# EAGLE board FindMeSAT_MB_1V2 (EAGLE 7.7.0)
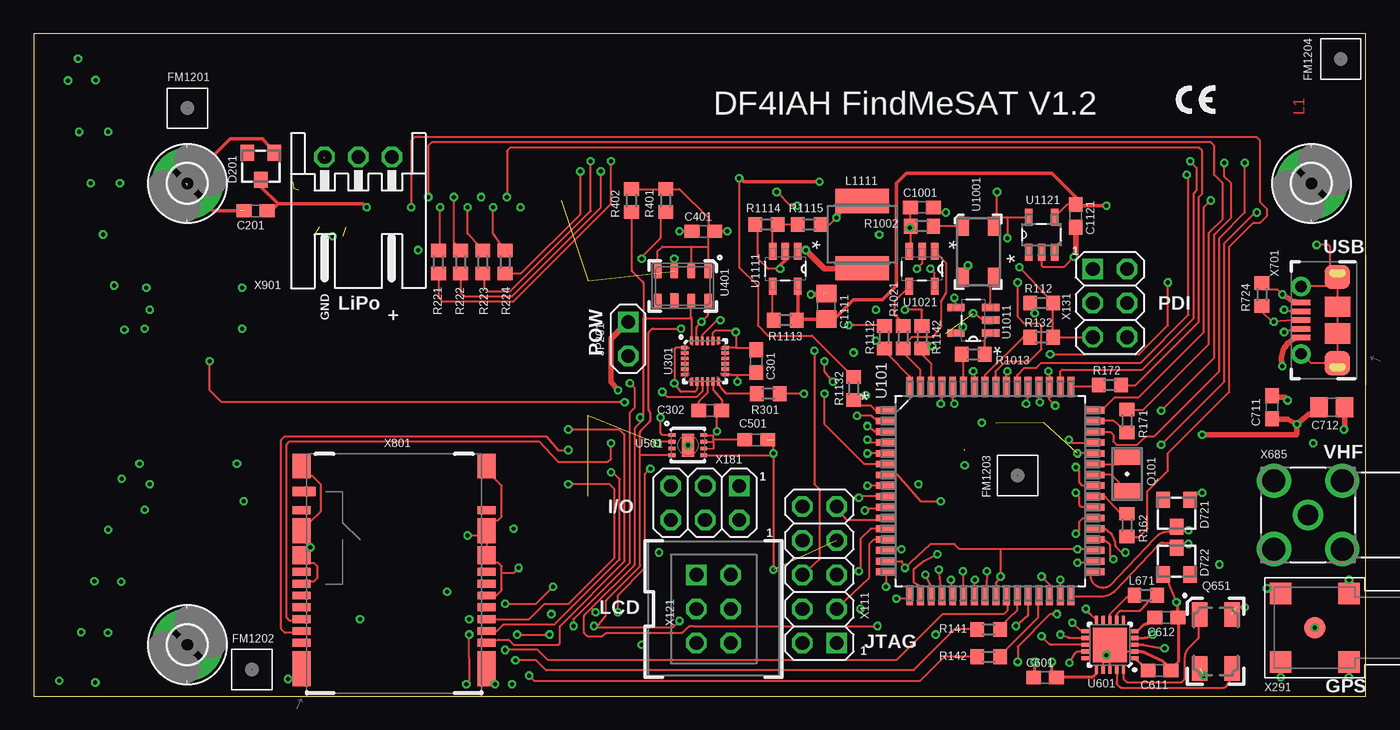
[diagram p12: board, top side]
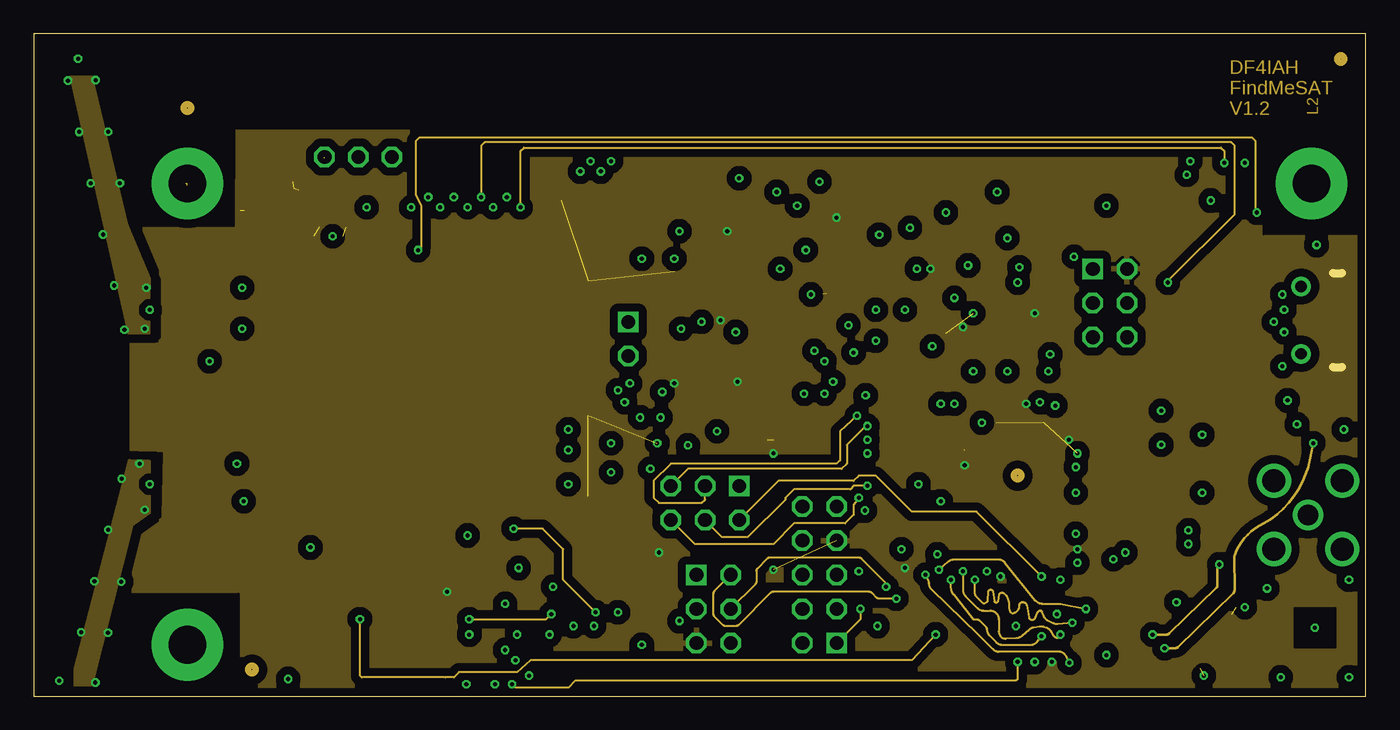
[diagram p13: board, inner layer Route2]
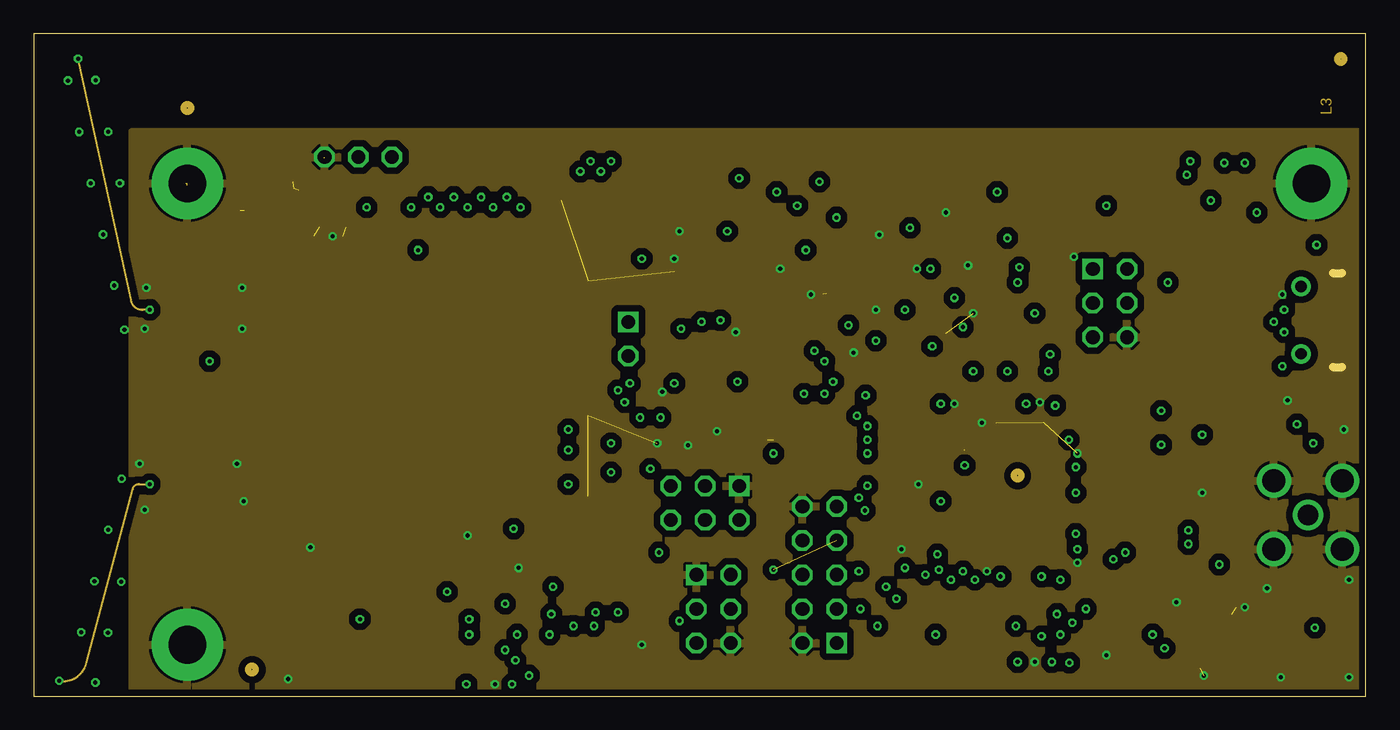
[diagram p14: board, inner layer Route15]
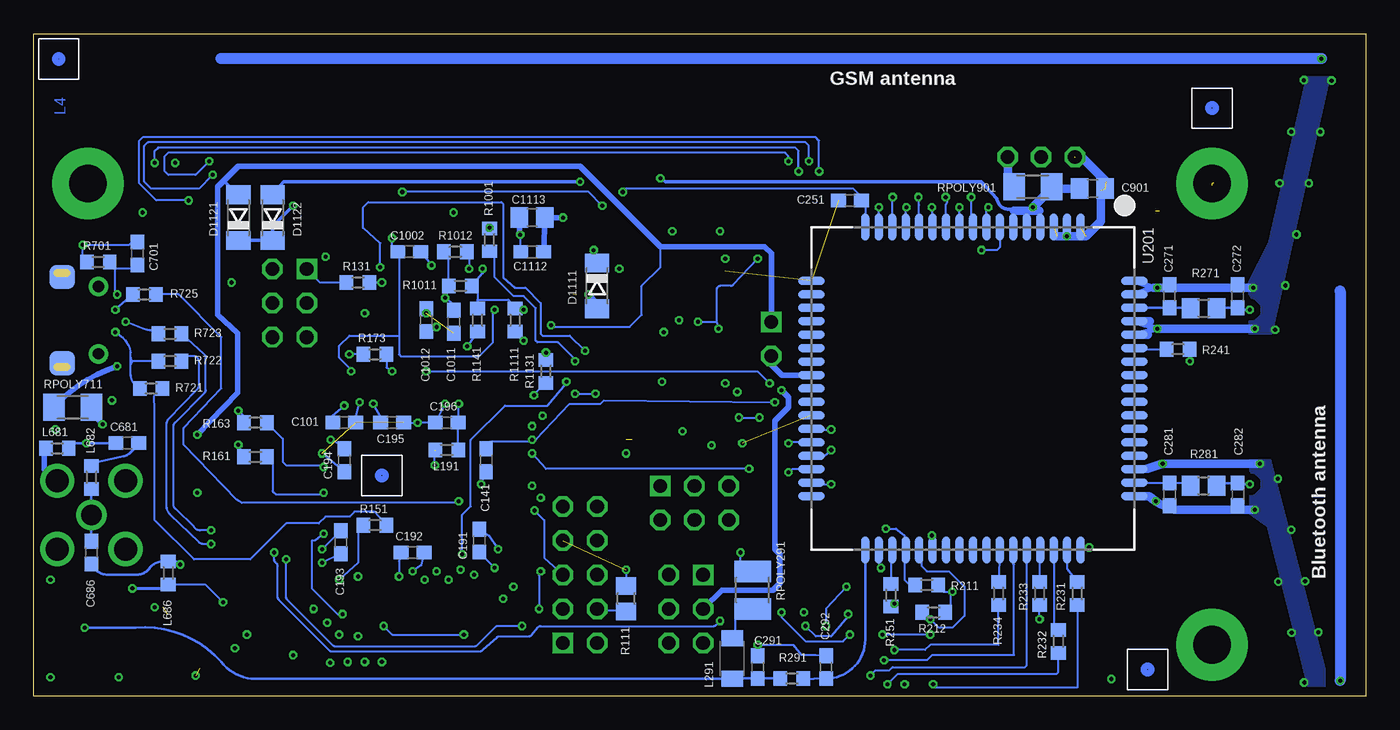
[diagram p15: board, bottom side, seen from below]

Size 99.04 x 49.23 mm. Coordinates in mm from the lower left corner, seen from the top.
Outline: 99.04,49.23 0,49.23 0,0 99.04,0 99.04,49.23
Copper layers (1+2*15+16): Top 0.035mm / dielectric 0.12mm / Route2 0.035mm / dielectric 1.2mm / Route15 0.035mm / dielectric 0.12mm / Bottom 0.035mm
Design rules "FindMeSAT_MB_1V2 *": minimum track width 6mil, minimum drill 12mil, track to track 6mil, track to pad 0.3mm, pad to pad 0.3mm, via to via 0.3mm, smd to smd 0mil, copper to edge 20mil, drill to drill 8mil, minimum pad ring 6mil, minimum via ring 6mil, stop-mask expansion 0.05mm, vias tented up to drill 0.35mm, thermal gap 0.2mm
Net classes: 1 pwr2A: width 0.8 mm; 2 R50: width 0.203 mm, clearance 0.9 mm; 3 R90_USB: width 0.15 mm, clearance 0.203 mm; 4 pwrA5: width 0.4 mm; 5 R75: width 0.15 mm, clearance 0.203 mm; 6 R110_SPI: width 0.15 mm, clearance 0.15 mm; 7 +3V3: clearance 0.5 mm; 8 GND: clearance 0.5 mm
tKeepout: area 0,0 to 99.1,49.2
bKeepout: area 0,0 to 99.1,49.2
tRestrict: area 21.6,1.3 to 31.8,17.8
bRestrict: area 19.1,12.7 to 39.4,33

## Footprints (pad centres in the part's own frame; a part is rotated, then mirrored left to right if it is on the bottom)
C0603 = smd 1.1 x 1: 1 -0.85,0; 2 0.85,0
C0805 = smd 1.3 x 1.5: 1 -0.95,0; 2 0.95,0
TO236 = smd 1 x 1.2: A -1,-1; C 0,1; NC 1,-1
SOD80C = smd 1.4 x 1.8: A 1.7,0; C -1.7,0
2,8-PAD = drill 2.8 pad 5.334: B2,8 0,0
1X02 = drill 1.016 square: 1 0,0 | drill 1.016 octagon: 2 0,2.54
R0603 = smd 1 x 1.1: 1 -0.85,0; 2 0.85,0
L3216C = smd 1.2 x 1.6: 1 -1.5,0; 2 1.5,0
L5650M = smd 1.8 x 4: 1 -2.5,0; 2 2.5,0
ABS07 = smd 1.1 x 1.9: 1 -1.25,0; 2 1.25,0
ABM03B = smd 1.8 x 1.2: 1 -2,-1.2; 2 2,-1.2; 3 2,1.2; 4 -2,1.2
R0805 = smd 1.3 x 1.5: 1 -0.95,0; 2 0.95,0
R1210 = smd 1.6 x 2.7: 1 -1.4,0; 2 1.4,0
M1206 = smd 1.6 x 2: 1 -1.4,0; 2 1.4,0
QFP80P1600X1600X120-64N = smd 1.473 x 0.508: 1 -7.747,5.994; 2 -7.747,5.207; 3 -7.747,4.394; 4 -7.747,3.607; 5 -7.747,2.794; 6 -7.747,2.007; 7 -7.747,1.194; 8 -7.747,0.406; 9 -7.747,-0.406; 10 -7.747,-1.194; 11 -7.747,-2.007; 12 -7.747,-2.794; 13 -7.747,-3.607; 14 -7.747,-4.394; 15 -7.747,-5.207; 16 -7.747,-5.994; 33 7.747,-5.994; 34 7.747,-5.207; 35 7.747,-4.394; 36 7.747,-3.607; 37 7.747,-2.794; 38 7.747,-2.007; 39 7.747,-1.194; 40 7.747,-0.406; 41 7.747,0.406; 42 7.747,1.194; 43 7.747,2.007; 44 7.747,2.794; 45 7.747,3.607; 46 7.747,4.394; 47 7.747,5.207; 48 7.747,5.994 | smd 0.508 x 1.473: 17 -5.994,-7.747; 18 -5.207,-7.747; 19 -4.394,-7.747; 20 -3.607,-7.747; 21 -2.794,-7.747; 22 -2.007,-7.747; 23 -1.194,-7.747; 24 -0.406,-7.747; 25 0.406,-7.747; 26 1.194,-7.747; 27 2.007,-7.747; 28 2.794,-7.747; 29 3.607,-7.747; 30 4.394,-7.747; 31 5.207,-7.747; 32 5.994,-7.747; 49 5.994,7.747; 50 5.207,7.747; 51 4.394,7.747; 52 3.607,7.747; 53 2.794,7.747; 54 2.007,7.747; 55 1.194,7.747; 56 0.406,7.747; 57 -0.406,7.747; 58 -1.194,7.747; 59 -2.007,7.747; 60 -2.794,7.747; 61 -3.607,7.747; 62 -4.394,7.747; 63 -5.207,7.747; 64 -5.994,7.747
SIM808 = smd 2 x 0.6: 1 -12,8; 2 -12,7; 3 -12,6; 4 -12,5; 5 -12,4; 6 -12,3; 7 -12,2; 8 -12,1; 9 -12,0; 10 -12,-1; 11 -12,-2; 12 -12,-3; 13 -12,-4; 14 -12,-5; 15 -12,-6; 16 -12,-7; 17 -12,-8; 35 12,-8; 36 12,-7; 37 12,-6; 38 12,-5; 39 12,-4; 40 12,-3; 41 12,-2; 42 12,-1; 43 12,0; 44 12,1; 45 12,2; 46 12,3; 47 12,4; 48 12,5; 49 12,6; 50 12,7; 51 12,8 | smd 0.6 x 2: 18 -8,-12; 19 -7,-12; 20 -6,-12; 21 -5,-12; 22 -4,-12; 23 -3,-12; 24 -2,-12; 25 -1,-12; 26 0,-12; 27 1,-12; 28 2,-12; 29 3,-12; 30 4,-12; 31 5,-12; 32 6,-12; 33 7,-12; 34 8,-12; 52 8,12; 53 7,12; 54 6,12; 55 5,12; 56 4,12; 57 3,12; 58 2,12; 59 1,12; 60 0,12; 61 -1,12; 62 -2,12; 63 -3,12; 64 -4,12; 65 -5,12; 66 -6,12; 67 -7,12; 68 -8,12
QFN24-3X3 = smd 0.495 x 0.25: 1 -1.552,1; 6 -1.552,-1; 13 1.552,-1; 18 1.552,1 | smd 0.6 x 0.25: 2 -1.5,0.6; 3 -1.5,0.2; 4 -1.5,-0.2; 5 -1.5,-0.6; 14 1.5,-0.6; 15 1.5,-0.2; 16 1.5,0.2; 17 1.5,0.6 | smd 0.25 x 0.495: 7 -1,-1.552; 12 1,-1.552; 19 1,1.552; 24 -1,1.552 | smd 0.25 x 0.6: 8 -0.6,-1.5; 9 -0.2,-1.5; 10 0.2,-1.5; 11 0.6,-1.5; 20 0.6,1.5; 21 0.2,1.5; 22 -0.2,1.5; 23 -0.6,1.5
MS5607-02BA = smd 1.1 x 0.6: 1 -1.1,1.875; 2 -1.1,0.625; 3 -1.1,-0.625; 4 -1.1,-1.875; 5 1.1,-1.875; 7 1.1,0.625; 8 1.1,1.875 | smd 1.1 x 0.67: 6 1.1,-0.625
DFN8/SHT = smd 0.55 x 0.25: 1 -1.177,0.765; 2 -1.177,0.265; 3 -1.177,-0.235; 4 -1.177,-0.735; 5 1.173,-0.735; 6 1.173,-0.235; 7 1.173,0.265; 8 1.173,0.765 | smd 0.9 x 1.7: 9 -0.002,0.015
QFN20-4X4-0P5-PAD = smd 0.6 x 0.3: 1 -1.85,1; 2 -1.85,0.5; 3 -1.85,0; 4 -1.85,-0.5; 5 -1.85,-1; 11 1.85,-1; 12 1.85,-0.5; 13 1.85,0; 14 1.85,0.5; 15 1.85,1 | smd 0.3 x 0.6: 6 -1,-1.85; 7 -0.5,-1.85; 8 0,-1.85; 9 0.5,-1.85; 10 1,-1.85; 16 1,1.85; 17 0.5,1.85; 18 0,1.85; 19 -0.5,1.85; 20 -1,1.85 | smd 2.55 x 2.55: 21 0,0
CFPT-141 = smd 0.9 x 1.4: 1 -1.15,1.9; 2 -1.15,-1.9; 3 1.15,-1.9; 4 1.15,1.9
SOT-23-5 = smd 1.27 x 0.559: 1 -1.295,0.94; 2 -1.295,0; 3 -1.295,-0.94; 4 1.295,-0.94; 5 1.295,0.94
SOT95P280X145-5N = smd 1.27 x 0.559: 1 -1.295,0.94; 2 -1.295,0; 3 -1.295,-0.94; 4 1.295,-0.94; 5 1.295,0.94
SOT95P285X120-5N = smd 1.27 x 0.533: 1 -1.295,0.965; 2 -1.295,0; 3 -1.295,-0.965; 4 1.295,-0.965; 5 1.295,0.965
2X05 = drill 1.016 square: 1 -5.08,-1.27 | drill 1.016 octagon: 2 -5.08,1.27; 3 -2.54,-1.27; 4 -2.54,1.27; 5 0,-1.27; 6 0,1.27; 7 2.54,-1.27; 8 2.54,1.27; 9 5.08,-1.27; 10 5.08,1.27
MOLEX_90130_2X03 = drill 1.016 square: 1 -2.54,-1.27 | drill 1.016 octagon: 2 -2.54,1.27; 3 0,-1.27; 4 0,1.27; 5 2.54,-1.27; 6 2.54,1.27
2X03 = drill 1.016 square: 1 -2.54,-1.27 | drill 1.016 octagon: 2 -2.54,1.27; 3 0,-1.27; 4 0,1.27; 5 2.54,-1.27; 6 2.54,1.27
MCX-J-P-X-RA-SM1 = smd 1.6 x 1.6: 1 0,0; 2 -2.54,2.54; 3 2.54,2.54; 4 -2.54,-2.54; 5 2.54,-2.54
SMA_SMT_AMPHENOL_901-143 = drill 1.499: 1 0,0 | drill 1.702: 2 -2.54,2.54; 3 -2.54,-2.54; 4 2.54,-2.54; 5 2.54,2.54
USB-B-MICRO-SMD_MOLEX-105017-0001 = smd 0.4 x 1.35: D+ 0,4.15; D- -0.65,4.15; GND 1.3,4.15; ID 0.65,4.15; VBUS -1.3,4.15 | drill 0.85 pad 1.45: JSHIELD -2.5,4.15; JSHIELD@2 2.5,4.15 | smd 1.8 x 1.9 bottom: JSHIELD@1 -3.2,1.45; JSHIELD@7 3.2,1.45 | smd 1.8 x 1.9: JSHIELD@3 -3.2,1.45; JSHIELD@6 3.2,1.45 | smd 1.5 x 1.9: JSHIELD@4 -1,1.45; JSHIELD@5 1,1.45
MICROSIM-8P_SDCARD-8P_MOLEX-104642-1610 = smd 1.35 x 2.6: G1 -6.875,-7.04; G8 6.875,-7.04 | smd 1.35 x 1.34: G2 -6.875,1.36; G7 6.875,1.36 | smd 1.35 x 1.84: G3 -6.875,3.2; G6 6.875,3.2 | smd 1.35 x 1.8: G4 -6.875,8.01; G5 6.875,8.01 | smd 1.35 x 0.58: S1 6.875,-5.13; S2 6.875,-4.25; S3 -6.875,-4.25; S4 -6.875,-5.13; S5 6.875,-1.61; S6 6.875,-3.37; S7 -6.875,-3.37; S8 -6.875,-1.61; T1 6.875,4.71; T2 6.875,0.15; T3 6.875,-0.73; T4 6.875,-2.49; T5 -6.875,-2.49; T6 -6.875,-0.73; T7 -6.875,0.15; T8 -6.875,4.71 | smd 1.7 x 0.7: SW -6.7,6.125
JST_S3B-XH-A = drill 1.016 octagon: 1 -2.5,-4.5; 2 0,-4.5; 3 2.5,-4.5

## Placement (x,y rotation side)
C101  100nF  [C0603]  75.95,20.32 0 bottom
C141  100pF  [C0603]  65.41,17.53 270 bottom
C191  100nF  [C0603]  65.91,11.56 90 bottom
C192  100nF  [C0603]  70.87,10.67 0 bottom
C193  100nF  [C0603]  76.2,11.43 270 bottom
C194  100nF  [C0603]  75.95,17.53 270 bottom
C195  100nF  [C0603]  72.39,20.32 0 bottom
C196  100nF  [C0603]  68.33,20.32 180 bottom
C201  100pF  [C0603]  16.51,36.07 180 top
C251  100pF  [C0603]  38.35,36.83 180 bottom
C271  0pF  [C0603]  14.61,29.72 90 bottom
C272  0pF  [C0603]  9.53,29.72 90 bottom
C281  0pF  [C0603]  14.61,14.99 270 bottom
C282  0pF  [C0603]  9.53,14.99 270 bottom
C291  0pF  [C0603]  45.21,2.16 90 bottom
C292  0pF  [C0603]  40.13,2.16 90 bottom
C301  100nF  [C0603]  53.72,24.89 90 top
C302  100nF  [C0603]  50.29,21.21 0 top
C401  100nF  [C0603]  49.78,34.54 180 top
C501  100nF  [C0603]  53.72,19.05 180 top
C601  100nF  [C0603]  75.18,1.4 180 top
C611  100nF  [C0603]  83.69,1.91 0 top
C612  100nF  [C0603]  84.2,5.84 0 top
C681  82pF  [C0603]  92.08,18.8 0 bottom
C686  150pF  [C0603]  94.74,10.67 90 bottom
C701  1nF  [C0603]  91.31,32.89 270 bottom
C711  100nF  [C0603]  92.08,21.46 90 top
C712  47uF  [C0805]  96.52,21.46 0 top
C901  100uF  [C0805]  20.32,37.72 0 bottom
C1001  10uF  [C0603]  66.04,36.32 0 top
C1002  100nF  [C0603]  71.12,33.02 0 bottom
C1011  100pF  [C0603]  67.82,27.81 270 bottom
C1012  100nF  [C0603]  69.85,27.94 90 bottom
C1111  47uF  [C0805]  58.93,28.96 90 top
C1112  100nF  [C0603]  61.98,33.02 180 bottom
C1113  47uF  [C0805]  61.98,35.56 180 bottom
C1121  100nF  [C0603]  77.47,35.69 270 top
D201  BZX84-5V1  [TO236]  16.89,39.37 180 top
D721  BZX84-3V6  [TO236]  84.96,13.59 180 top
D722  BZX84-3V6  [TO236]  84.96,10.03 0 top
D1111  CRS08  [SOD80C]  57.15,30.48 270 bottom
D1121  CRS08  [SOD80C]  83.82,35.56 90 bottom
D1122  CRS08  [SOD80C]  81.28,35.56 90 bottom
FM1201  FIDUCIAL_MARK_1MM  [FIDUCIAL_MARK_1MM]  11.43,43.69 0 top
FM1202  FIDUCIAL_MARK_1MM  [FIDUCIAL_MARK_1MM]  16.24,1.97 0 top
FM1203  FIDUCIAL_MARK_1MM  [FIDUCIAL_MARK_1MM]  73.15,16.38 0 top
FM1204  FIDUCIAL_MARK_1MM  [FIDUCIAL_MARK_1MM]  97.17,47.36 0 top
H1201  MOUNT-PAD-ROUND2.8  [2,8-PAD]  95,38.1 180 top
H1203  MOUNT-PAD-ROUND2.8  [2,8-PAD]  11.43,38.1 180 top
H1204  MOUNT-PAD-ROUND2.8  [2,8-PAD]  11.43,3.81 180 top
JP201  POW  [1X02]  44.2,27.81 180 top
L191  10uH  [R0603]  68.33,18.29 180 bottom
L291  WE-CBF_300R  [L3216C]  47.12,2.79 270 bottom
L671  22nH  [R0603]  82.68,7.49 0 top
L681  100nH  [R0603]  97.28,18.41 180 bottom
L682  56nH  [R0603]  94.74,16.26 270 bottom
L686  33nH  [R0603]  89.03,9.14 90 bottom
L1111  4.7uH  [L5650M]  61.59,34.29 270 top
Q101  ABS07-32.768KHZ  [ABS07]  81.28,16.51 90 top
Q651  ABM3B-16MHZ-10-R50-1-U  [ABM03B]  87.88,4.06 270 top
R111  0R  [R0805]  54.99,7.24 90 bottom
R112  10kR  [R0603]  74.93,29.21 180 top
R131  68R  [R0603]  74.93,30.73 0 bottom
R132  68R  [R0603]  74.93,26.67 180 top
R141  68R  [R0603]  70.99,4.95 180 top
R142  68R  [R0603]  70.99,2.92 180 top
R151  68R  [R0603]  73.66,12.7 0 bottom
R161  4.7kR  [R0603]  82.55,17.78 180 bottom
R162  68R  [R0603]  81.28,12.7 270 top
R163  68R  [R0603]  82.55,20.32 180 bottom
R171  68R  [R0603]  81.28,20.45 90 top
R172  68R  [R0603]  80.01,23.11 0 top
R173  68R  [R0603]  73.66,25.4 180 bottom
R211  10kR  [R0603]  32.64,8.26 180 bottom
R212  10kR  [R0603]  32.13,6.22 180 bottom
R221  68R  [R0603]  30.1,32.26 90 top
R222  68R  [R0603]  31.75,32.26 90 top
R223  68R  [R0603]  33.4,32.26 90 top
R224  68R  [R0603]  35.05,32.26 90 top
R231  68R  [R0603]  21.46,7.62 270 bottom
R232  68R  [R0603]  22.86,4.06 270 bottom
R233  68R  [R0603]  24.26,7.62 270 bottom
R234  68R  [R0603]  27.3,7.62 270 bottom
R241  68R  [R0603]  13.97,25.78 0 bottom
R251  68R  [R0603]  35.31,7.49 90 bottom
R271  0R  [R0805]  12.06,28.83 0 bottom
R281  0R  [R0805]  12.06,15.64 0 bottom
R291  0R  [R0603]  42.67,1.31 0 bottom
R301  68R  [R0603]  54.61,22.48 0 top
R401  10kR  [R0603]  46.99,36.83 90 top
R402  10kR  [R0603]  44.45,36.83 90 top
R701  330kR  [R0603]  94.23,32.26 0 bottom
R721  1.5kR  [R0603]  90.3,22.86 0 bottom
R722  68R  [R0603]  88.9,24.89 0 bottom
R723  68R  [R0603]  88.9,26.92 0 bottom
R724  1MR  [R0603]  91.31,29.84 90 top
R725  68R  [R0603]  90.81,29.84 0 bottom
R1001  100kR  [R0603]  65.15,33.91 90 bottom
R1002  10kR  [R0603]  66.04,34.92 0 top
R1011  100kR  [R0603]  67.31,30.48 180 bottom
R1012  330kR  [R0603]  67.69,33.02 0 bottom
R1013  47R  [R0603]  69.85,25.4 180 top
R1021  27R  [R0603]  64.64,26.67 270 top
R1111  4.02kR  [R0603]  63.25,27.94 270 bottom
R1112  6.04kR  [R0603]  63.25,26.67 90 top
R1113  100kR  [R0603]  55.88,27.94 180 top
R1114  15kR  [R0603]  54.48,35.05 0 top
R1115  68kR  [R0603]  57.66,35.05 0 top
R1131  4.02kR  [R0603]  60.96,24.13 90 bottom
R1132  6.04kR  [R0603]  60.96,22.86 270 top
R1141  100pF  [R0603]  66.04,27.94 270 bottom
R1142  2.0kR  [R0603]  66.04,26.67 90 top
RPOLY291  50mA/150mA  [R1210]  45.59,7.87 90 bottom
RPOLY711  1.1A/2.2A  [M1206]  96.14,21.46 0 bottom
RPOLY901  1.1A/2.2A  [M1206]  24.77,37.85 0 bottom
U101  ATXMEGA256A3BU-AU  [QFP80P1600X1600X120-64N]  71.12,15.24 0 top
U201  SIM808  [SIM808]  29.21,22.86 270 bottom
U301  MPU-9250  [QFN24-3X3]  49.91,24.89 0 top
U401  MS5607-02BA03  [MS5607-02BA]  48.26,30.48 270 top
U501  SHT31-DIS  [DFN8/SHT]  48.64,18.63 0 top
U601  AX5243  [QFN20-4X4-0P5-PAD]  80.01,3.81 180 top
U1001  CFPT-141-20MHZ  [CFPT-141]  70.23,33.02 0 top
U1011  OPA354  [SOT-23-5]  69.85,27.94 180 top
U1021  OPA354  [SOT-23-5]  66.04,31.75 270 top
U1111  LM2831YMF  [SOT95P280X145-5N]  55.88,31.75 270 top
U1121  LM4120IM5-3.0  [SOT95P285X120-5N]  74.93,34.29 90 top
X111  AVR-JTAG-10  [2X05]  58.42,9.02 90 top
X121  MOLEX_90130_2X03  [MOLEX_90130_2X03]  50.55,6.48 270 top
X131  HEADER-2X3  [2X03]  80.01,29.21 270 top
X181  HEADER-2X3  [2X03]  49.91,14.35 180 top
X291  MCX-J-P-X-RA-SM1  [MCX-J-P-X-RA-SM1]  95.25,5.08 270 top
X685  SMA_CON  [SMA_SMT_AMPHENOL_901-143]  94.74,13.46 270 top
X701  MOLEX_105017-0001  [USB-B-MICRO-SMD_MOLEX-105017-0001]  98.38,27.94 90 top
X801  MICROSIM-8P_SDCARD-8P_MOLEX-104642-1610  [MICROSIM-8P_SDCARD-8P_MOLEX-104642-1610]  26.8,9.09 0 top
X901  JST_S3B-XH-A  [JST_S3B-XH-A]  24.13,35.56 180 top

## Tracks (layer width: path | path; a pad name or v marks a point on that pad's centre or on a via)
+3V0  (via drill 0.3)
  Top 0.152: U1001.4 71.38,35.3 | 71.38,35.3 71.67,35.59 72.39,35.59 | 72.39,35.59 U1121.5 | 72.39,35.59 v72.39,34.04 | R1142.2 66.04,28.7 v64.77,28.7 | 75.44,23.06 U101.51 | v71.63,37.47 71.63,35.56 71.38,35.31 71.38,35.3 | v55.24,37.47 56.26,36.45 v56.77,36.45 | v75.95,21.59 75.51,22.02 U101.51 | v75.44,24.13 75.51,24.05 U101.51
  Bottom 0.152: C101.1 76.83,20.36 76.83,20.83 v75.95,21.59 | U201.17 37.17,36.96 C251.1 37.59,37.17 38.1,37.72 54.99,37.72 v55.24,37.47 | v72.39,34.04 72.39,33.34 C1002.1 71.88,32.93 71.88,26.8 | 71.88,26.8 71.88,25.4 71.75,25.27 65.91,25.27 64.9,26.29 64.9,28.57 v64.77,28.7 | v75.44,24.13 75.44,24.26 76.33,25.15 76.33,26.04 75.56,26.8 71.88,26.8 | v56.77,36.45 57.78,37.47 v71.63,37.47
+3V3  (via drill 0.3)  (3 unrouted)
  Top 0.152: U101.45 78.61,18.8 77.22,18.8 v76.96,19.05 | U101.35 78.11,10.92 v77.6,10.92 71.88,10.92 | U101.15 64.52,10.03 v64.77,9.53 66.67,11.3 68.45,11.3 68.83,10.92 71.88,10.92 | R1115.2 59.18,35.05 v59.69,35.56 | L1111.1 59.94,36.2 | U1021.5 66.98,31.45 v66.67,31.75 | U1011.5 v69.09,27.43 | R112.2 74.42,28.87 v74.42,28.45 | U301.22 49.71,26.85 50.8,27.94 v51.05,27.94 | U301.13 51.86,23.88 52.32,23.88 | U301.1 47.74,25.89 47.62,25.78 v47.62,23.24 48.13,22.61 49.15,22.61 49.31,22.77 U301.8 | U501.5 52.47,17.91 54.86,17.91 v54.99,18.03 | 75.95,1.4 C601.1 | 52.32,23.88 53.72,23.88 C301.1 | U101.25 71.53,8.41 v71.88,8.89 71.88,10.92 | v73.79,21.72 73.91,21.84 U101.53 | U401.4 46.35,31.61 46.35,33.02 46.74,33.4 48.9,33.4 | v51.56,34.54 50.67,34.54 | 50.67,34.54 C401.1 50.16,34.25 50.16,33.4 | U401.1 50.16,31.61 50.16,33.4 | 48.9,33.4 50.16,33.4 | U401.2 48.9,31.58 48.9,33.4 | 50.67,34.54 50.29,34.92 50.16,34.92 50.16,35.56 48.01,37.68 47.5,37.68 47.37,37.59 46.99,37.72 arc-180 R401.2 R402.2 | v54.99,18.03 v54.99,9.4 | v52.32,23.37 52.32,23.88 | v54.99,18.03 54.99,19.05
  Top 0.225: U601.16 79.01,1.77 arc-45 78.94,1.59 78.81,1.47 arc-45 78.64,1.4 75.95,1.4 75.69,1.4 v75.69,2.54
  Top 0.406: 59.94,36.2 v59.69,35.56
  Bottom 0.152: C195.1 73.28,20.36 73.28,20.83 v73.79,21.72 | C194.1 76.45,18.8 v76.96,19.05 | C193.1 v77.6,10.92 | C191.1 v64.77,9.53 | C192.1 71.88,10.03 v71.88,8.89 | R1012.2 66.67,32.77 66.67,31.88 66.71,31.84 v66.67,31.75 | C1012.1 v69.09,27.43 | 46.36,9.4 RPOLY291.2 46.35,9.53 46.48,9.53 v46.48,10.67 | R212.1 30.86,6.6 30.86,7.75 v30.73,7.75 31.37,7.75 31.62,8.26 R211.1 | v54.99,9.4 54.99,8.51 55.12,8.26 R111.2 | v69.22,17.14 69.22,18.29
  Bottom 0.406: C1112.1 C1113.1 v59.69,35.56
  pour Route2 (isolate 0.61, rank 2): 98.5,41.91 7.32,41.91 7.32,0.5 98.5,0.5
+5V  (via drill 0.3)
  Top 0.15: R1112.2 63.08,27.52 63.12,27.56 v60.58,27.56
  Top 0.406: v86.87,19.43 93.85,19.43 93.92,19.5 v93.92,20.19 | C712.1 95.57,21.27 95.25,20.95 94.81,20.95 v93.92,20.19 | C711.1 92.2,20.57 93.22,20.57 v93.92,20.19 | v43.43,22.73 42.93,23.37 42.93,26.54 JP201.1
  Bottom 0.15: 84.74,38.1 85.09,38.1 | v60.58,27.56 60.45,27.56 60.33,27.43 54.74,27.43 53.85,28.32 53.85,30.48 52.45,31.88 52.45,33.27 52.32,33.4
  Bottom 0.254: 83.9,37.26 84.74,38.1
  Bottom 0.406: v86.87,19.43 83.88,22.54 83.88,26.95 85.34,28.32 85.34,37.85 85.09,38.1 83.82,39.37 58.42,39.37 52.45,33.4 52.32,33.4 44.7,33.4 44.2,32.89 JP201.1 | 83.82,37.34 83.9,37.26 D1121.A | RPOLY711.2 94.61,21.59 94.36,21.34 94.36,20.7 94.17,20.51 v93.92,20.19 | v43.43,22.73 42.93,22.23 42.93,21.46 43.94,20.45 43.94,10.92 43.56,10.54 43.56,8.38 44.07,7.87 47.88,7.87 X121.3
AD_3V0  (via drill 0.3)
  Top 0.152: U101.62 66.73,24.71 66.04,25.4 R1142.1 66.17,25.91 66.72,25.91 v66.8,25.99
  Bottom 0.152: R1141.2 v66.8,25.99
AD_5V0  (via drill 0.3)
  Top 0.152: U101.64 65.13,23.77 63.5,25.4 R1112.1 63.33,25.82 v62.61,26.42
  Bottom 0.152: R1111.2 63.41,27.09 v62.61,26.42
AD_VBAT  (via drill 0.3)
  Top 0.152: U101.1 62.59,21.23 62.23,21.59 61.38,21.59 R1132.2 61.3,22.35 v61.85,22.35
  Bottom 0.152: v61.85,22.35 61.63,22.61 R1131.1
AD_VCTCXO
  Top 0.152: U101.63 65.91,24.26 64.77,25.4 R1021.2 64.77,26.04 64.77,26.16 65.28,26.67 66.8,26.67 67.44,27.43 67.44,29.34 67.82,29.97 67.82,32.21 U1021.1
AVCC  (via drill 0.3)
  Top 0.152: U101.61 67.56,22.99 v67.44,21.72
  Bottom 0.152: v67.44,21.72 67.44,20.32 C196.1 L191.1
AX_ANT
  Bottom 0.203: C686.2 X685.1 L682.2
AX_ANT_I
  Bottom 0.203: C681.2 91.72,18.22 arc36 92.39,17.81 94.19,17.4 L682.1
AX_ANTN  (via drill 0.3)
  Top 0.203: U601.4 82.41,4.31 arc34 83.12,4.53 v83.19,4.57
  Route2 0.203: v83.19,4.57 84.2,4.57 arc44 84.42,4.66 87.91,8.03 arc46 88.01,8.26 88.01,9.52 arc-45 88.1,9.74 v88.14,9.78
  Bottom 0.203: C686.1 94.57,9.57 arc-56 93.52,9.02 91.38,9.02 arc-53 90.46,9.48 arc53 89.44,9.99 L686.2 88.35,9.99 v88.14,9.78
AX_ANTP  (via drill 0.3)
  Top 0.203: U601.3 82.31,3.81 arc-10 82.54,3.79 83.82,3.56
  Top 0.225: 83.82,3.56 v84.07,3.56
  Route2 0.203: v84.07,3.56 84.83,3.56 arc44 85.06,3.65 89.19,7.65 arc46 89.28,7.88 89.27,10.4 89.29,10.47 arc-45 91.44,12.83 arc45 94.74,17.02 v95.12,18.8
  Bottom 0.203: L681.1 96.18,18.8 v95.12,18.8 C681.1
AX_CLK  (via drill 0.3)
  Top 0.152: U601.11 77.85,4.87 v77.22,5.46 | U101.23 69.93,8.59 v69.98,8.64
  Route2 0.152: v69.98,8.64 69.98,7.6 arc45 70.05,7.42 70.54,6.93 arc45 70.7,6.9 70.9,7.02 arc47 70.93,7.07 70.97,7.8 arc-136 71.32,7.78 71.41,7.03 arc129 71.71,7.06 71.78,7.57 arc-119 72.2,7.55 72.22,7.56 arc-50 72.5,6.57 72.55,6.37 arc7 72.65,6.22 72.74,6.15 arc90 73.28,6.73 arc-90 73.53,6.99 arc-80 73.83,6.74 73.99,5.87 arc98 74.31,5.68 arc50 74.47,5.82 74.61,6.19 arc-68 74.85,6.35 arc-68 74.96,6.27 75.09,5.94 arc42 75.4,5.61 75.78,5.42 arc32 76.13,5.35 v77.22,5.46
AX_IRQ  (via drill 0.3)
  Top 0.152: v77,2.47 77.38,3.14 arc-60 77.65,3.3 U601.14 | 66.73,8.08 v66.29,9.02
  Top 0.279: U101.19 66.73,8.08
  Route2 0.152: v66.29,9.02 66.5,8.61 arc-27 66.55,8.4 arc46 66.74,7.94 70.23,4.57 71.31,3.49 arc45 71.76,3.3 76.19,3.3 arc-63 76.76,2.95 v77,2.47
AX_L1
  Top 0.152: U601.8 80.01,5.99 arc-45 80.08,6.17 81.23,7.32 arc-32 81.35,7.38 L671.1
AX_L2
  Top 0.152: U601.7 80.52,5.99 arc-44 80.59,6.17 80.7,6.28 arc-45 80.88,6.35 82.18,6.35 arc49 82.37,6.44 83.19,7.37 L671.2
AX_MISO  (via drill 0.3)
  Top 0.152: U601.12 77.08,4.32 arc-21 76.85,4.36 v76.33,4.57 | v69.09,9.27 69.09,7.52
  Top 0.279: 69.09,7.52 U101.22
  Route2 0.152: v69.09,9.27 69.09,7.88 arc45 69.27,7.43 70.17,6.54 arc45 70.62,6.35 71.11,6.35 arc-45 71.56,6.16 71.57,6.16 arc-45 71.75,5.71 71.75,4.83 arc45 71.94,4.39 71.98,4.35 arc45 72.3,4.28 73.04,4.32 arc41 73.46,4.47 74.03,4.96 arc-31 74.34,5.11 74.77,5.18 arc-28 75.08,5.16 75.31,5.08 75.38,5.05 arc-37 75.66,4.76 75.74,4.6 arc63 76.2,4.32 v76.33,4.57
AX_MOSI  (via drill 0.3)
  Top 0.152: U601.13 75.7,3.81 arc-45 75.47,3.9 v74.93,4.45 | U101.21 v68.2,8.64
  Route2 0.152: v68.2,8.64 68.2,8 arc43 68.37,7.56 69.75,5.8 69.83,5.72 arc45 69.91,5.7 70,5.7 arc-45 70.32,5.62 70.78,5.16 arc-45 70.87,4.96 arc45 71.05,4.51 71.57,4 arc45 72.02,3.81 74.12,3.81 arc51 74.61,4.05 v74.93,4.45
AX_SEL  (via drill 0.3)
  Top 0.152: U601.10 78.57,6.1 v78.23,6.48 | 67.51,7.54 v67.31,9.4
  Top 0.279: U101.20 67.51,7.54
  Route2 0.152: v67.31,9.4 68.02,10.01 arc-41 68.43,10.16 71.71,10.16 arc-51 72.2,9.92 74.48,7.09 arc51 74.98,6.86 76.32,6.86 arc-11 76.34,6.86 v78.23,6.48
BATTERY
  Bottom 0.64: RPOLY901.1 26.63,37.85 X901.1
BT_ANT  (via drill 0.3)
  Route15 0.15: v1.91,1.14 arc90 3.94,2.54 7.37,15.37 arc-90 7.87,15.75 v8.64,15.75
  Bottom 0.203: R281.2 10.87,15.64 10.68,15.83 C282.1 | v8.64,15.75 9.53,15.75
  Bottom 0.604: 9.53,15.75 C282.1
  Bottom 0.8: 1.91,30.1 v1.91,1.14
BT_RF
  Bottom 0.203: U201.53 C281.1 13.6,15.85 13.39,15.64 R281.1
CLK16N
  Top 0.152: U601.19 80.51,1 arc45 80.58,0.82 80.7,0.71 arc45 80.88,0.64 88.5,0.64 arc59 88.72,0.76 89.03,1.27 89.03,1.81
  Top 0.225: 89.03,1.81 Q651.3
CLK16P
  Top 0.152: U601.20 81.01,1.39 arc45 81.08,1.21 81.21,1.09 arc45 81.39,1.02 85.24,1.02 arc45 85.42,1.09 85.52,1.2 arc45 85.6,1.38 85.6,2.89 arc-45 85.89,3.6 86.54,4.24 arc45 86.61,4.42 86.61,5.18 Q651.1
CTS1  (via drill 0.3)
  Top 0.152: U101.55 72.31,24.05 v72.39,24.13
  Bottom 0.152: R173.1 72.81,24.42 v72.39,24.13
DCD1
  Top 0.152: R171.1 80.3,20.45 U101.47
DTR1  (via drill 0.3)
  Top 0.152: U101.46 80.06,19.63 80.26,19.43 80.26,18.92 80.52,18.67 82.04,18.67 82.68,19.3 83.31,19.3 88.14,24.13 88.14,34.04 90.04,35.94 v90.04,39.62 | R222.1 31.75,29.97 32,29.72 35.56,29.72 42.16,36.32 v42.16,38.99
  Bottom 0.152: v90.04,39.62 90.04,40.51 89.79,40.77 42.42,40.77 42.16,40.51 v42.16,38.99
EN
  Top 0.152: R1113.2 54.94,28.03 U1111.4
FB
  Top 0.152: U1111.3 54.94,34.66 R1114.2 R1115.1
GAM_RO
  Top 0.152: U301.10 50.11,22.55 49.44,21.88 C302.1
GND  (via drill 0.3)  (19 unrouted)
  Top 0.152: v97.79,8.64 X291.2 | v97.79,1.4 X291.3 | v92.71,1.4 X291.5 | v91.69,8 X291.4 | v64.52,10.92 63.88,10.92 63.42,10.79 U101.14 | 70.74,7.52 U101.24 70.84,8.1 v70.87,9.27 | 70.74,7.52 70.74,7.49 | 70.74,7.52 70.87,7.75 | U101.44 v77.6,18.03 | D722.A 84.33,8.51 v84.96,6.99 85.05,7.02 | U101.34 78.11,9.91 v77.6,9.91 | v55.5,31.75 54.61,31.75 53.85,32.51 53.85,34.84 R1114.1 | U1021.2 66.04,32.13 v65.66,31.75 | X801.T6 19.95,8.38 20.32,8.51 20.83,8.51 21.08,8.76 21.08,9.65 20.83,9.91 20.45,9.91 X801.G2 20.32,10.65 v20.57,11.05 20.19,11.69 X801.G3 20.32,12.74 20.19,12.45 20.57,12.95 21.34,13.72 21.34,15.75 20.7,16.38 20.32,16.38 19.92,16.78 X801.G4 | v18.92,1.27 19.94,1.65 19.92,1.65 X801.G1 19.94,2.1 19.94,2.03 | 33.53,1.14 33.53,1.96 X801.G8 33.67,1.38 v34.29,0.89 | U1011.2 70.61,27.94 v69.85,28.45 | U1001.2 v69.47,32 | C1001.2 67.31,35.94 v67.82,35.94 | U1121.2 74.93,32 75.06,31.88 76.58,31.88 v77.34,32.64 77.47,32.77 | U301.9 49.71,22.66 49.28,22.23 47.12,22.23 v46.74,22.61 | U301.20 50.51,27.02 50.67,27.18 52.07,27.18 v52.2,27.05 52.2,25.89 | C501.2 50.55,19.05 | U501.8 50.55,19.4 | U501.7 50.55,18.9 | 50.55,18.9 50.55,19.05 | 50.55,19.05 50.55,19.4 | 50.55,19.4 v50.8,19.68 50.8,21.04 C302.2 51.18,21.63 51.18,21.97 50.51,22.77 U301.11 | 34.42,7.49 33.5,7.49 X801.S5 33.7,7.41 34.42,7.49 | X801.G6 33.67,12.3 33.66,12.32 33.66,10.5 33.67,10.5 X801.G7 34.02,9.91 34.54,9.91 34.8,9.65 34.8,9.14 | X801.G6 33.68,12.22 33.91,13.08 34.54,13.08 34.8,13.34 34.8,15.65 34.16,16.26 33.67,16.75 X801.G5 | 34.42,7.49 34.8,7.87 34.8,9.14 | 52.2,25.89 U301.18 | D721.A 85.98,14.84 v86.87,15.11 | R724.2 91.31,30.23 92.46,30.23 v92.84,29.84
  Top 0.152: U601.18 80.01,2.54 | 80.01,2.54 U601.21 | U601.17 79.51,2.53 | 79.51,2.53 79.5,2.54 | U601.2 81.03,3.31 80.01,2.54 | 79.51,2.53 80.01,2.54 | 80.01,2.54 v79.76,3.05 | U501.2 46.48,18.9 v46.35,18.8 | 52.2,25.89 53.72,25.89 C301.2 | v68.45,21.72 68.33,21.97 U101.60 | v74.8,21.84 74.73,21.92 U101.52 | v36.05,9.53 35.69,9.14 34.8,9.14 | U401.3 47.63,32.5 v47.62,32.51 | v48.01,34.54 C401.2 | U501.6 50.55,18.41 50.55,18.9 | v32.26,11.94 33.52,11.94 X801.G6 | v90.04,6.6 89.41,6.6
  Top 0.225: C601.2 74.42,1.52 v74.42,2.54 | 81.03,3.31 81.03,3.3 | U601.2 82.17,3.3 arc-25 82.65,3.2 83.78,2.68 arc-29 84.27,2.28 C611.2 84.71,2.16 85.09,2.54 85.09,5.68 C612.2 85.05,7.02
  Top 0.254: U1111.2 55.88,32.38 55.5,32 v55.5,31.75 | D201.A 17.02,41.4 14.61,41.4 11.3,38.1 | 15.37,36.07 13.34,36.07 11.43,37.97
  Top 0.406: X701.GND 93.6,29.34 v92.84,29.84 | C1121.2 77.47,32.77 | C712.2 97.47,19.75 v97.41,19.81 | C711.2 92.2,22.23 93.03,22.23 v93.22,21.97 | 58.67,29.84 v57.78,29.84
  Bottom 0.152: C292.2 40.89,3.05 41.91,3.05 42.55,3.81 v45.21,3.81 C291.2 | U201.36 36.2,10.45 36.2,9.65 v36.05,9.53 | C191.2 65.22,11.94 v64.52,10.92 | C192.2 70.23,9.72 v70.87,9.27 | C194.2 v77.6,18.03 | C101.2 75.06,20.36 75.06,20.83 v74.8,21.84 | v68.45,21.72 C196.2 v70.48,20.32 C195.2 | C193.2 v77.6,9.91 | D1111.A 57.15,29.21 | C1112.2 62.93,34.35 v62.87,34.29 | v65.66,31.75 65.66,31.41 R1011.1 66.04,30.48 R1141.1 66.04,29.46 63.75,29.46 R1111.1 62.83,28.79 v62.61,28.7 | U201.51 21.21,10.79 21.04,10.97 20.7,10.97 v20.57,11.05 | v69.85,28.45 70.23,28.51 C1012.2 | C1002.2 v69.47,32 | R1131.2 v60.96,25.53 | v65.79,15.75 C141.2 | v92.84,29.84 92.96,29.72 92.96,31.75 | 92.96,31.75 93.38,32.17 R701.2 | C701.2 91.61,31.75 92.96,31.75 | L686.1 86.27,8.29 v84.96,6.99 | U201.40 32.21,11.89 v32.26,11.94
  Bottom 0.225: v91.69,8 89.45,8 L686.1 | 98.26,18.29 L681.2
  Bottom 0.406: 57.15,29.21 v57.78,29.84 | C1113.2 62.93,34.35 | X685.2 98.26,16.85 98.26,18.29 | 15.81,30.35 U201.68 | 15.79,30.35 U201.67 | U201.65 v15.49,27.3 U201.64
  Bottom 0.64: 15.81,30.35 15.79,30.35 v15.49,30.35 14.82,30.35 C271.2 14.1,30.35 9.91,30.35 C272.2 9.31,30.35 v8.38,30.35 | U201.65 16.05,27.86 | U201.64 16.19,26.86 | v8.26,13.84 9.49,13.84 | 9.49,13.84 arc90 C282.2 9.82,13.84 | 9.49,13.84 14.22,13.84 14.52,14.14 C281.2 arc37 v15.62,14.48 16.13,14.86 U201.52 | U201.54 16.26,16.89 v15.11,17.27 v7.87,17.27 | U201.2 v22.23,34.16 | v8.26,27.3 v15.49,27.3 | 21.59,40.01 21.08,40.01 19.3,38.23 | 22.99,34.16 20.83,34.16 19.68,35.31 19.68,37.59
  other vias: 48.64,18.63 87,1.52 2.56,45.74 4.6,45.78 3.38,41.93 5.54,41.93 4.24,38.11 6.41,38.12 5.16,34.3 4.59,1.01 5.53,4.71 3.53,4.75 4.52,8.53 6.54,16.15 5.98,30.51 6.75,27.22 5.54,12.37 6.51,8.5
  pour Route15 (rank 2): 98.5,41.91 7.32,41.91 7.32,0.5 98.5,0.5
  pour Bottom (no thermals): 8.64,16.51 arc180 8.64,14.99 8.64,13.59 7.32,12.67 4.32,0.76 3.05,0.76 3.05,2.03 7.11,17.58 8.64,17.53
  pour Bottom (no thermals): 8.64,27.94 arc-180 8.64,29.46 8.69,30.73 7.2,33.7 4.36,46.02 2.73,46.01 7.01,26.93 8.64,26.92
  pour Route2 (no thermals): 8.64,16.51 arc180 8.64,14.99 8.64,13.59 7.32,12.65 4.32,0.76 3.05,0.76 3.05,2.03 7.11,17.58 8.64,17.53
  pour Route2 (no thermals): 8.64,27.94 arc-180 8.64,29.46 8.67,31 7,34.99 4.37,46.01 2.72,46.02 7.02,26.96 8.64,26.92
GPS_1PPS  (via drill 0.3)
  Top 0.152: v35.05,6.86 37.34,6.86 v38.61,8.13 | v44.32,23.24 44.7,22.86 44.7,21.46 44.32,21.08 44.32,9.91 40.13,5.71 v40.13,5.21 | 69.85,23.5 69.98,23.04 U101.58 69.93,24.05 v69.85,24.13
  Bottom 0.152: R251.1 35.34,6.86 v35.05,6.86 | v38.61,8.13 40.13,6.48 v40.13,5.21 | v69.85,24.13 45.21,24.13 v44.32,23.24
GPS_1PPS_DRV
  Bottom 0.152: U201.37 35.31,10.81 R251.2
GPS_ANT  (via drill 0.3)
  Bottom 0.203: R291.1 C291.1 47.12,1.31 | X291.1 91.44,5.08 arc53 85.09,2.54 arc-53 82.55,1.29 L291.2
  Bottom 0.64: 47.12,1.31 L291.2
  other vias: 95.25,5.08
GPS_PWR
  Bottom 0.152: L291.1 46.86,4.7 46.87,5.97 RPOLY291.1
GPS_RF_IN
  Bottom 0.203: U201.35 37.21,4.19 arc90 C292.1 41.91,1.27
  Bottom 0.406: 41.91,1.27 R291.2
GSM_ANT  (via drill 0.3)
  Route15 0.15: v8.64,28.7 8.13,28.7 arc-90 7.24,29.46 v3.3,47.37
  Bottom 0.203: R271.2 11.3,28.87 C272.1 | v8.64,28.7 9.53,28.7
  Bottom 0.604: 9.53,28.7 C272.1
  Bottom 0.8: v3.3,47.37 85.1,47.37
GSM_CTS  (via drill 0.3)
  Top 0.152: R223.2 32.26,34.38 v32.26,36.32
  Bottom 0.152: U201.12 32.21,36.53 arc-90 v32.26,36.32
GSM_DCD  (via drill 0.3)
  Top 0.152: R222.2 31.24,33.74 v31.24,37.08
  Bottom 0.152: U201.11 31.21,36.54 arc-90 v31.24,37.08
GSM_DTR  (via drill 0.3)
  Top 0.152: R171.2 82.51,21.3 87.38,26.16 87.38,34.42 88.39,35.43 88.39,38.1 87.76,38.73 87.76,40.89 87.5,41.15 29.59,41.15 29.34,40.89 v29.34,37.08
  Bottom 0.152: U201.9 29.34,35.69 v29.34,37.08
GSM_NETLIGHT  (via drill 0.3)
  Top 0.152: v32.16,0.89 32.4,0.89 32.4,1.16 v32.38,4.57 | v43.43,6.22 43.43,7.49 45.47,9.53 45.47,16.51 v45.85,16.89 | v35.94,4.57 v38.37,4.57 | U101.5 v61.98,18.03
  Bottom 0.152: v32.38,4.57 v35.94,4.57 | v43.43,6.22 43.43,5.84 41.66,4.06 38.86,4.06 v38.37,4.57 | v45.85,16.89 60.96,16.89 v61.98,18.03 | R231.2 21.46,0.64 32.26,0.64 v32.16,0.89
GSM_NETLIGHT_DRV
  Bottom 0.152: U201.50 22.21,9.47 R231.1
GSM_PCM_CLK  (via drill 0.3)
  Top 0.152: R141.2 68.45,4.95 65.41,1.91 38.1,1.91 37.34,2.67 v35.81,2.67
  Bottom 0.152: U201.46 26.21,9.78 26.16,9.78 26.16,3.05 32.26,3.05 32.64,2.67 v35.81,2.67
GSM_PCM_CLK_DRV
  Top 0.152: R141.1 71.88,5.21 73.13,6.36 U101.27
GSM_PCM_IN  (via drill 0.3)
  Top 0.152: R142.2 67.69,2.92 65.91,1.14 37.21,1.14 v36.83,1.52
  Bottom 0.152: v36.83,1.52 36.45,1.91 35.43,1.91 35.18,2.16 25.34,2.16 25.21,2.29 U201.47
GSM_PCM_IN_DRV
  Top 0.152: R142.1 72.52,3.68 74.68,5.84 74.68,7.44 U101.29
GSM_PCM_OUT  (via drill 0.3)
  Top 0.152: U101.28 73.91,5.97 v73.03,5.21
  Route2 0.152: v67.06,4.57 65.28,2.67 36.96,2.67 35.94,1.78 31.62,1.78 31.24,1.4 30.61,1.4 24.38,1.4 24.26,1.52 v24.26,5.71
  Bottom 0.152: v73.03,5.21 72.39,4.57 v67.06,4.57 | v24.26,5.71 R233.2
GSM_PCM_OUT_DRV
  Bottom 0.152: U201.48 24.26,10.41 R233.1
GSM_PCM_SYNC  (via drill 0.3)
  Top 0.152: U101.26 72.31,7.54 arc-90 72.39,7.62 72.39,6.35 72.14,6.1 67.56,6.1 64.14,2.67 38.23,2.67 37.47,3.43 v35.05,3.43
  Bottom 0.152: R234.2 27.3,3.81 32.38,3.81 32.77,3.43 v35.05,3.43
GSM_PCM_SYNC_DRV
  Bottom 0.152: U201.45 27.3,8.43 R234.1
GSM_PWRKEY  (via drill 0.3)
  Top 0.152: R162.2 82.21,11.85 81.66,11.81 82.17,11.81 82.8,12.45 82.8,15.24 84.33,16.76 84.33,18.03 88.9,22.61 88.9,33.4 90.68,35.18 91.19,35.18 91.69,35.69 91.69,36.2 91.19,36.7 91.19,41.27 90.93,41.53 28.32,41.53 28.07,41.27 v28.07,36.32
  Bottom 0.152: U201.8 28.21,36.56 arc90 v28.07,36.32
GSM_RESET  (via drill 0.3)
  Top 0.152: v83.82,21.21 87.76,25.15 87.76,34.29 89.03,35.56 89.03,38.1 88.52,38.61 v88.52,39.62
  Route2 0.152: v36.2,36.32 36.2,40.51 36.45,40.77 88.27,40.77 88.52,40.51 v88.52,39.62
  Bottom 0.152: U201.16 36.2,35.27 v36.2,36.32 | R163.2 83.4,20.79 v83.82,21.21
GSM_RF
  Bottom 0.203: R271.1 13.34,28.87 C271.1 U201.66
GSM_RF_SYNC  (via drill 0.3)
  Top 0.152: 63.32,18.8 U101.4 62.18,18.85 v61.98,19.05 | v43.94,21.84 13.97,21.84 13.08,22.73 v13.08,24.89
  Bottom 0.152: v43.94,21.84 56.64,21.97 56.9,21.72 59.18,21.72 61.72,19.05 v61.98,19.05 62.1,18.92 65.02,18.92 65.15,18.8 C141.1 | v13.08,24.89 13.08,25.78 R241.2
GSM_RF_SYNC_DRV
  Bottom 0.152: U201.63 16.73,25.78 R241.1
GSM_RI  (via drill 0.3)
  Top 0.152: R221.2 30.23,33.49 v30.23,36.32
  Bottom 0.152: U201.10 30.21,36.43 arc-90 v30.23,36.32
GSM_RTS  (via drill 0.3)
  Top 0.152: v75.56,25.4 82.17,25.4 84.33,27.56 v84.33,30.73
  Route2 0.152: v33.27,37.08 33.27,40.89 33.53,41.15 89.03,41.15 89.28,40.89 89.28,35.81 84.33,30.86 v84.33,30.73
  Bottom 0.152: U201.13 33.21,36.51 v33.27,37.08 | R173.2 v75.56,25.4
GSM_RXD  (via drill 0.3)
  Top 0.152: R172.2 81.92,23.11 86.61,27.81 86.61,37.08 86.87,37.34 86.87,40.51 86.61,40.77 35.43,40.77 35.18,40.51 v35.18,37.08
  Bottom 0.152: U201.15 35.18,35.29 v35.18,37.08
GSM_STATUS  (via drill 0.3)
  Top 0.152: v77.47,12.06 77.72,12.32 77.72,12.95 78,13.23 U101.38 | v76.07,6.1 75.56,6.1 73.15,3.68 v73.15,2.54
  Route2 0.152: v35.56,0.89 35.81,0.64 39.75,0.64 40.26,1.14 73.03,1.14 73.15,1.27 v73.15,2.54
  Bottom 0.152: v77.47,12.06 78.11,11.56 78.36,11.56 78.36,8 76.45,6.1 v76.07,6.1 | v35.56,0.89 34.8,1.65 22.99,1.65 22.86,1.78 R232.2
GSM_STATUS_DRV
  Bottom 0.152: U201.49 23.21,5.26 R232.1
GSM_TXD  (via drill 0.3)
  Top 0.152: R224.2 34.16,34.38 v34.16,36.32
  Bottom 0.152: U201.14 34.21,36.53 arc90 v34.16,36.32
GSM_VDD_EXT  (via drill 0.3)
  Top 0.152: v83.82,18.67 88.52,23.37 88.52,33.66 90.81,35.94 v90.93,35.94
  Route2 0.152: v28.57,33.15 28.83,33.4 28.83,36.45 28.45,37.21 28.45,41.27 28.7,41.53 90.55,41.53 90.81,41.27 90.81,36.07 v90.93,35.94
  Bottom 0.152: U201.7 27.21,33.37 27.43,33.15 v28.57,33.15 | R161.2 83.4,17.87 v83.82,18.67
I2C2_INT  (via drill 0.3)
  Top 0.152: U101.6 61.75,17.25 58.8,20.19 v58.8,22.48 | v57.28,22.48 55.75,22.48 R301.2
  Bottom 0.152: v58.8,22.48 v57.28,22.48
IO_ADC4  (via drill 0.3)
  Top 0.152: U101.2 62.74,20.45 62.23,20.83 v61.21,20.83
  Route2 0.152: v61.21,20.83 59.94,19.68 59.94,17.53 59.69,17.27 47.37,17.27 46.1,16 46.1,14.73 46.48,14.35 49.66,14.35 49.91,14.61 X181.3
IO_ADC5  (via drill 0.3)
  Top 0.152: U101.3 62.53,19.63 v61.98,20.07
  Route2 0.152: v61.98,20.07 61.85,20.07 60.45,18.67 60.45,17.27 60.07,16.89 48.64,16.89 X181.5
IO_DAC0  (via drill 0.3)
  Top 0.152: U101.8 61.98,15.65 v61.98,15.62
  Route2 0.152: v61.98,15.62 60.96,15.62 60.71,15.37 56.52,15.37 55.88,14.73 55.88,14.61 53.09,11.81 51.18,11.81 X181.4
IO_DAC1  (via drill 0.3)
  Top 0.152: U101.9 61.47,14.83 v61.34,14.73
  Route2 0.152: v61.34,14.73 60.96,14.22 60.96,13.46 60.33,12.83 56.52,12.83 54.99,11.3 49.15,11.3 X181.6
IO_OC1A  (via drill 0.3)
  Top 0.152: U101.30 75.51,8.31 v74.93,8.89
  Route2 0.152: X181.2 55.37,16 60.96,16 61.34,16.38 62.61,16.38 65.28,13.72 70.1,13.72 v74.93,8.89
J_D+  (via drill 0.3)
  Top 0.15: 93.6,27.94 v92.2,27.81
  Top 0.152: R724.1 91.31,28.57 92.08,27.81 v92.2,27.81
  Top 0.35: X701.D+ 93.6,27.94
  Bottom 0.15: R723.1 89.92,27.18 90.31,27.18 arc21 90.77,27.26 v92.2,27.81
J_D-  (via drill 0.3)
  Top 0.15: v92.96,27.05 93.6,27.3
  Top 0.35: X701.D- 93.89,27.26 93.81,27.26 93.6,27.3
  Bottom 0.15: R722.1 91.69,24.89 | 91.82,25.15 91.82,25.53 arc-44 92.39,26.6 v92.96,27.05
  Bottom 0.152: 91.69,24.89 91.82,24.89 | R721.1 91.44,23.11 arc53 91.82,23.88 91.82,24.64 | 91.82,24.64 91.82,24.89 | 91.82,24.89 91.82,25.15 91.69,24.89 | 91.69,24.89 91.82,24.64
J_ID  (via drill 0.3)
  Top 0.152: X701.ID 93.2,28.59 v92.96,28.7
  Bottom 0.152: R725.1 v92.96,28.7
J_SHIELD  (via drill 0.3)
  Top 0.152: 96.27,31.85 arc90 X701.JSHIELD@6 X701.JSHIELD@5 X701.JSHIELD@4 X701.JSHIELD@3 94.97,24.74 X701.JSHIELD | 96.27,31.85 96.27,30.44 X701.JSHIELD@2 | 96.27,31.85 96.39,31.85 96.39,33.4 96.27,33.53 v95.38,33.53
  Bottom 0.152: C701.1 91.73,33.74 91.95,33.53 v95.38,33.53 95.38,32.55 R701.1
J_VUSB  (via drill 0.3)
  Top 0.406: v92.84,24.51 arc-90 93.95,26.64 X701.VBUS
  Bottom 0.406: v92.84,24.51 arc-30 RPOLY711.1
MPU_INT
  Top 0.152: R301.1 51.52,22.48 51.05,22.99 50.93,23.32 U301.12
N$1
  cutout Route2 (no thermals): 91.44,41.91 98.58,41.93 98.58,34.31 91.44,34.29
N$2
  cutout Route2: 6.93,7.61 15.24,7.62 15.26,0.59 6.95,0.58
N$3
  cutout Route2: 7.62,41.91 14.89,41.91 14.87,34.93 7.6,34.93
N$4
  cutout Route2: 93.75,6.56 96.78,6.56 96.78,3.6 93.75,3.6
PDI_CLK  (via drill 0.3)
  Top 0.152: X131.5 R132.1 R112.1 75.78,29.25 73.53,31.62 v73.28,31.88 | v58.04,25.65 58.04,15.75 58.42,15.37 58.42,10.16 X111.6
  Bottom 0.152: v73.28,31.88 73.28,33.66 74.55,34.8 74.55,36.32 74.17,36.7 64.26,36.7 64.14,36.58 64.14,31.11 63.25,30.35 62.48,30.35 61.34,29.21 61.34,26.92 61.21,26.8 59.18,26.8 v58.04,25.65
PDI_CLK_CPU
  Top 0.152: U101.57 70.74,23.01 70.74,23.88 73.57,26.67 73.79,26.8 R132.2
PDI_DATA
  Bottom 0.152: R131.1 77.72,30.73 X131.1
PDI_DATA_CPU  (via drill 0.3)
  Top 0.152: U101.56 71.53,24.16 72.26,24.89 74.04,24.89 74.93,25.78 74.93,27.56 74.8,27.69 73.66,27.69 73.15,28.19 v73.15,30.73
  Bottom 0.152: v73.15,30.73 R131.2
POWERED_GSM  (via drill 0.3)
  Top 0.152: U101.39 77.9,14.05 77.72,14.22 77.72,14.86 v77.47,15.11
  Bottom 0.152: R161.1 81.28,17.36 81.28,15.24 81.03,14.99 77.6,14.99 v77.47,15.11
PWRKEY_GSM
  Top 0.152: R162.1 80.81,13.55 79.5,14.99 78.89,14.99 U101.40
RESET_GSM  (via drill 0.3)
  Top 0.152: U101.41 77.95,15.65 77.72,15.88 77.72,16.76 v77.47,17.02
  Bottom 0.152: R163.1 80.52,19.14 80.52,17.4 80.26,17.14 77.6,17.14 v77.47,17.02
RI1  (via drill 0.3)
  Top 0.152: U101.50 76.33,24.13 76.45,24.26 82.42,24.26 86.23,28.07 86.23,37.34 86.49,37.59 86.49,39.24 v85.98,39.75 | R221.1 30.1,29.59 30.35,29.34 35.69,29.34 42.93,36.58 v42.93,39.75
  Bottom 0.152: v85.98,39.75 87,38.73 89.03,38.73 89.28,38.99 89.28,40.13 89.03,40.39 43.18,40.39 42.93,40.13 v42.93,39.75
RTS1  (via drill 0.3)
  Top 0.152: U101.54 73.13,23.85 73.66,24.38 74.55,24.38 74.93,24.77 82.3,24.77 85.85,28.32 85.85,38.61 v85.72,38.73 | R223.1 33.49,31.11 33.49,30.39 33.78,30.1 35.43,30.1 41.4,36.07 v41.4,39.75
  Bottom 0.152: v85.72,38.73 86.74,37.72 90.3,37.72 90.81,38.23 90.81,40.89 90.55,41.15 41.66,41.15 41.4,40.89 v41.4,39.75
RXD1  (via drill 0.3)
  Top 0.152: U101.48 79.4,21.23 80.39,22.23 82.17,22.23 87,27.05 87,36.32 v87.5,36.83 | R224.1 36.23,31.41 40.64,35.81 v40.64,38.99
  Bottom 0.152: v87.5,36.83 89.92,36.83 91.19,38.1 91.19,41.27 90.93,41.53 40.89,41.53 40.64,41.27 v40.64,38.99
SCL1  (via drill 0.3)
  Top 0.152: 45.09,17.91 45.09,9.76 arc-45 45.01,9.58 42.62,7.19 arc45 42.55,7.01 42.55,6.06 arc-39 42.49,5.9 42.04,5.33 v41.66,5.21 41.53,5.08 47.39,5.08 arc45 47.57,5.15 v48.01,5.59 | 45.09,17.91 45.09,19.58 arc-45 45.16,19.76 45.77,20.37 arc45 45.85,20.55 45.85,20.98 arc45 45.77,21.16 arc-45 45.72,21.28 45.72,26.95 arc-45 45.79,27.12 45.9,27.23 arc-45 46.08,27.3 v48.13,27.3 | U301.23 49.28,26.43 49.28,27.33 arc-45 49.35,27.51 v49.66,27.81 50.06,28.22 arc45 50.13,28.4 U401.8 | U501.4 46.74,17.9 45.72,17.91 45.09,17.91 | U101.37 79.6,12.45 arc-37 79.66,12.43 80.08,12.11 arc-31 80.16,12 80.37,11.47 arc-22 80.39,11.38 80.39,11.28 arc45 80.47,11.1 80.83,10.74 arc45 81,10.67 v81.15,10.67 | R401.1 46.61,35.6 46.61,34.14 arc-45 46.53,33.96 45.29,32.71 arc45 45.21,32.53 v45.21,32.51
  Route2 0.152: v32.38,5.71 38.1,5.71 v38.48,6.1
  Bottom 0.152: v48.01,5.59 48.31,5.28 arc45 48.49,5.21 61.35,5.21 arc-50 61.54,5.12 62.03,4.54 arc50 62.22,4.45 64.42,4.45 arc-42 64.59,4.38 65.66,3.43 65.71,3.38 arc45 65.89,3.3 76.86,3.3 arc45 77.04,3.38 80.83,7.17 arc45 80.9,7.34 80.9,9.67 arc-45 80.97,9.85 81.08,9.96 arc45 81.15,10.14 v81.15,10.67 | v48.13,27.3 v48.14,27.3 | v49.66,27.81 48.26,27.81 | 48.26,27.81 v48.13,27.3 | 32.98,6.26 32.64,5.84 v32.38,5.71 31.75,5.08 30.73,5.08 29.84,5.97 29.84,8.13 30.99,9.27 32.64,9.27 33.02,9.65 33.02,10.27 U201.39 | v38.48,6.1 38.48,5.97 39.75,4.45 40.89,4.45 v41.66,5.21 | R212.2 32.98,6.26 | 32.98,6.26 32.98,6.31 33.02,6.35 33.02,6.6 32.64,6.6 | v45.21,32.51 47.04,30.56 arc47 47.23,30.48 48.01,30.48 arc-90 48.26,30.23 48.26,27.81 | 48.26,27.81 48.14,27.3 v48.13,27.3
SCL2  (via drill 0.3)
  Top 0.152: U101.17 65.02,7.39 65.02,7.24 v64.14,7.24
  Route2 0.152: v64.14,7.24 62.84,7.24 arc-45 62.66,7.31 62.3,7.67 arc45 62.12,7.75 54.97,7.75 arc45 54.79,7.67 52.4,5.28 arc-45 52.22,5.21 51.41,5.21 arc-45 51.23,5.28 50.62,5.89 arc-45 50.55,6.07 50.55,7.64 arc-45 50.62,7.82 X121.2
SDA1  (via drill 0.3)
  Top 0.152: 41.4,6.48 40.97,6.04 arc45 40.89,5.86 40.89,4.8 arc45 40.97,4.62 41.07,4.52 arc45 41.25,4.45 42.19,4.45 arc45 42.37,4.52 42.47,4.62 arc-45 42.65,4.7 48.12,4.7 arc45 48.26,4.75 48.69,5.16 arc-45 49,5.21 v62.74,5.21 | 41.4,6.48 44.63,9.71 arc45 44.7,9.88 44.7,19.83 arc-45 44.78,20.01 45.34,20.57 | U101.36 arc-90 78.92,11.68 79.5,11.68 79.91,11.38 arc-53 80.01,11.18 80.01,10.52 arc45 80.08,10.34 v80.26,10.16 | 45.34,20.57 45.34,28.07 | 45.34,28.07 48.9,28.07 | 48.9,28.07 48.9,26.46 U301.24 | 45.34,20.57 45.21,20.7 v45.09,20.7 | U501.1 46.77,19.4 46.61,19.56 v46.61,20.7 | 48.9,28.07 48.88,28.2 U401.7 | R402.1 44.45,31.73 arc45 44.52,31.55 45.27,30.81 arc-45 45.34,30.63 45.34,28.07 | v41.78,6.22 41.53,6.48 41.4,6.48
  Route2 0.152: v41.78,6.22 39.37,8.64 39.37,10.92 37.85,12.45 v35.69,12.45
  Bottom 0.152: 33.87,8.29 R211.2 33.91,8.26 34.29,8.64 34.29,10.38 U201.38 34.29,10.94 34.29,11.94 34.92,12.45 v35.69,12.45 | v62.74,5.21 64.54,5.21 arc-45 64.72,5.13 66.09,3.76 arc45 66.27,3.68 76.6,3.68 arc45 76.78,3.76 80.19,7.17 arc45 80.26,7.34 v80.26,10.16 | v46.61,20.7 v45.09,20.7
SDA2  (via drill 0.3)
  Top 0.152: U101.16 v63.37,8.13
  Route2 0.152: v63.37,8.13 63.37,8.28 arc45 63.3,8.46 61.54,10.21 arc45 61.36,10.29 54.72,10.29 arc45 54.54,10.21 53.8,9.47 arc45 53.72,9.29 53.72,8.49 arc-45 53.65,8.31 X121.4
SHIELD_BT
  cutout Route2: 7.2,18.07 9.52,18.05 9.4,13.34 7.85,12.24 7.07,9.17 7.62,12.7 9.02,13.59 9.02,17.53 7.24,18.03
SHIELD_GSM
  cutout Route2: 7.1,36.37 8.69,31.97 9.14,30.86 9.14,26.67 7.11,26.67 7.11,26.29 9.02,26.29 9.4,26.67 9.4,30.99 9.01,31.84
SIM_CLK  (via drill 0.3)
  Top 0.152: X801.S3 19.81,4.7 18.67,4.7 18.41,4.95 18.41,19.05 18.67,19.3 38.1,19.3 38.99,18.29 v39.75,18.29
  Bottom 0.152: U201.31 40.26,17.86 v39.75,18.29
SIM_IO  (via drill 0.3)
  Top 0.152: X801.S7 19.81,5.59 19.03,5.59 18.8,5.84 18.8,18.67 19.05,18.92 37.59,18.92 38.99,17.4 42.67,17.4 42.93,17.65 v42.93,18.8
  Bottom 0.152: U201.30 42.93,18.86 v42.93,18.8
SIM_RST  (via drill 0.3)
  Top 0.152: X801.S2 33.8,4.83 34.42,4.83 34.92,5.33 38.73,5.33 43.56,10.16 43.56,16.13 43.05,16.64 v42.93,16.64
  Bottom 0.152: U201.32 42.64,16.86 v42.93,16.64
SIM_VBUS
  Bottom 0.406: U201.25 43.42,23.86 44.32,24.77 44.32,25.15 JP201.2
SIM_VCC  (via drill 0.3)
  Top 0.152: X801.S1 34.54,4.19 35.31,4.19 35.69,3.81 38.99,3.81 39.12,3.94 39.12,5.21 43.94,10.03 43.94,19.43 43.56,19.81 v39.75,19.81
  Bottom 0.152: U201.29 41.02,19.81 v39.75,19.81
SIM_VPP  (via drill 0.3)
  Top 0.152: X801.S6 33.98,5.71 36.83,5.71 37.97,6.86 39.75,6.86 43.18,10.29 43.18,15.37 42.8,15.75 v39.75,15.75
  Bottom 0.152: U201.33 40.48,15.75 v39.75,15.75
SW  (via drill 0.3)
  Top 0.152: U1111.1 56.92,33.15 v57.4,33.15 57.28,33.02 57.15,33.02 | L1111.2 60.96,31.75
  Top 0.406: 60.96,31.75 58.8,31.75 v57.4,33.15
  Bottom 0.152: D1111.C 57.4,32.43
  Bottom 0.406: 57.4,32.43 v57.4,33.15
TCK  (via drill 0.3)
  Top 0.152: U101.12 62.23,12.45 61.47,11.68 61.47,9.53 61.34,9.4 v61.34,9.27
  Route2 0.152: v61.47,6.48 61.47,5.71 X111.1
  Bottom 0.152: v61.34,9.27 61.34,9.14 61.47,9.02 v61.47,6.48
TCXO_20MHZ
  Top 0.152: U101.59 69.11,25.29 R1013.2
TDI
  Top 0.152: 59.56,13.97 X111.9 60.45,13.08 62.74,13.08 62.89,13.23 U101.11
TDO
  Top 0.152: U101.13 62.43,11.63 62.1,11.3 62.1,8.76 X111.3
TMS  (via drill 0.3)
  Top 0.152: v61.8,13.79 61.98,13.97 62.87,13.97 U101.10
  Bottom 0.152: X111.5 61.09,10.29 61.09,13.08 v61.8,13.79
TOSC1
  Top 0.152: U101.43 80.77,17.25 Q101.2
TOSC2
  Top 0.152: Q101.1 80.11,16.43 U101.42
TRSH  (via drill 0.3)
  Top 0.152: U1011.4 68.56,29.11 v68.45,29.59
  Bottom 0.152: C1011.1 67.82,29.08 v68.45,29.59 68.41,29.68 R1011.2 68.58,30.48 68.2,30.86 68.2,33.27 68.41,33.06 R1012.1
TXD1
  Top 0.152: R172.1 78.87,22.99 | 78.99,22.99 78.87,22.99 | 78.87,22.99 U101.49
USB_D_N  (via drill 0.3)
  Top 0.15: U101.32 77.24,7.37 79.38,7.37 arc30 80.35,7.75 83.57,11.18 arc-37 83.88,11.41 84.96,11.41 85.32,11.3 v85.85,11.3
  Top 0.35: D722.C 84.96,11.41
  Bottom 0.15: v85.85,11.3 86.32,11.3 arc46 86.74,11.43 88.92,13.53 arc48 89.15,14.22 89.15,20.19 arc38 89.03,20.57 86.89,22.8 arc-51 86.74,23.11 86.74,24.77 arc-88 87.12,25.27 87.88,25.27 | 87.92,25.02 R722.2
  Bottom 0.292: 87.88,25.27 87.92,25.02
USB_D_P  (via drill 0.3)
  Top 0.15: U101.33 78.61,9.14 78.61,8.76 arc117 80.03,8.23 83.31,11.68 arc-52 84.39,12.21 84.96,12.21 | 85.23,12.32 v85.85,12.32
  Top 0.35: 84.96,12.21 D721.C 85.23,12.32
  Bottom 0.15: v85.85,12.32 86.66,12.32 arc57 87.12,12.57 88.5,13.9 arc41 88.65,14.22 88.65,20.07 arc44 88.52,20.32 86.34,22.54 arc-49 86.23,22.73 86.23,25.15 arc-53 86.36,25.4 87.61,26.54 R723.2
USB_ID  (via drill 0.3)
  Top 0.152: v67.44,14.48 65.91,14.48 64.14,16.51 63.88,16.51 63.58,16.43 U101.7
  Bottom 0.152: v67.44,14.48 67.56,14.35 83.57,14.35 83.95,14.61 87.88,18.67 87.88,19.94 85.09,22.86 85.09,26.67 88.27,29.84 R725.2
USB_RESET
  Bottom 0.152: R151.2 73.7,13.72 75.18,13.72 75.56,13.34 77.34,13.34 77.85,12.83 80.26,12.83 82.93,10.16 87.12,10.16 90.04,13.08 90.04,21.21 90.08,22.31 R721.2
USB_RESET_DRV  (via drill 0.3)
  Top 0.152: U101.31 v76.33,8.64
  Bottom 0.152: R151.1 arc-90 74.93,12.28 74.93,9.91 v76.33,8.64
VBAT  (via drill 0.3)
  Top 0.15: v52.45,38.48 52.45,31.88 53.85,30.48 53.85,27.56 54.61,26.8 57.87,26.8 R1132.1
  Top 0.254: v58.42,38.23 52.83,38.23 v52.45,38.48 | 18.16,36.58 24.51,36.58 v24.77,36.32 | C201.1 17.65,36.07 18.16,36.58 | D201.C 16.89,37.85 18.16,36.58
  Bottom 0.15: U201.4 24.26,35.31 | U201.5 25.15,35.58 | U201.6 26.16,35.31
  Bottom 0.225: 24.26,35.31 24.26,36.07
  Bottom 0.254: D1122.A 80.44,38.23 v58.42,38.23 | v52.45,38.48 52.07,38.23 28.57,38.23 27.43,36.96 arc-90 26.42,36.2 26.16,36.07
  Bottom 0.35: 26.16,35.31 26.16,36.07 | 24.26,36.07 24.77,36.07 v24.77,36.32
  Bottom 0.406: 25.15,35.58 25.4,36.07
  Bottom 0.64: v24.77,36.32 23.24,37.85 RPOLY901.2 23.11,37.72 C901.1 | 24.26,36.07 25.4,36.07 26.16,36.07
VC_OP_FB
  Top 0.152: U1021.4 65.15,30.45 64.01,29.34 64.01,28.32 64.77,27.69 64.77,27.56 | R1021.1 64.9,27.52 64.9,27.56 64.77,27.56 | 64.77,27.43 64.77,27.56
VDD_ANA@1
  Top 0.225: U601.1 C611.1
VDD_ANA@5
  Top 0.152: 83.1,5.46 C612.1
  Top 0.225: U601.5 82.03,4.81 82.38,5.16 arc-45 83.1,5.46
VIN  (via drill 0.3)
  Top 0.15: U1121.3 75.89,33.35 76.33,33.78 76.33,34.92 75.89,35.36 U1121.4 76.82,36.51 C1121.1 77.47,36.45 | R1113.1 56.73,28.01 56.82,28.01
  Top 0.254: v79.76,36.45 77.47,36.45 | U1111.5 56.82,28.01 C1111.1 59.56,28.01 59.56,28.07 60.96,29.46 63.12,29.46 64.14,30.48 64.14,38.1 64.9,38.86 75.69,38.86 77.47,37.08 C1121.1
  Bottom 0.254: v79.76,36.45 81.28,34.92 D1122.C D1121.C
VREF
  Bottom 0.152: R111.1 55.43,6.35 57.02,6.35 X111.4
XO_AMP
  Top 0.152: R1013.1 70.7,26.55 U1011.1
XO_DRV
  Top 0.152: U1011.3 71.14,30.45 71.12,30.48 71.12,31 U1001.3
XO_LP  (via drill 0.3)
  Top 0.152: R1002.1 C1001.1 | R1002.1 65.19,33.13 U1021.3 | R1002.1 65.19,34.89 v65.15,34.8
  Bottom 0.152: R1001.2 65.32,34.76 v65.15,34.8
XO_VC
  Top 0.152: U1001.1 R1002.2
XO_VC_PWM  (via drill 0.3)
  Top 0.152: v59.44,23.37 58.8,24.13 v58.8,24.89 | v67.18,10.54 66.17,10.03 65.41,9.4 65.41,8.51 65.79,8.26 65.79,7.62 U101.18
  Bottom 0.152: v67.18,10.54 67.18,13.46 66.55,14.1 66.55,19.05 64.01,21.59 60.83,21.59 59.44,23.24 v59.44,23.37 | R1001.1 65.02,33.02 64.77,32.64 64.77,31.11 63.37,29.72 62.61,29.72 61.72,28.83 61.72,26.42 61.59,26.29 60.07,26.29 58.8,25.02 v58.8,24.89

## Text on the board
Top: L1
Route2: DF4IAH / FindMeSAT / V1.2 | L2
Route15: L3
Bottom: L4
tPlace: DF4IAH FindMeSAT V1.2 | 1 | USB | LiPo | PDI | GND | + | POW | VHF | 1 | I/O | 1 | LCD | JTAG | 1 | GPS
bPlace: GSM antenna | Bluetooth antenna